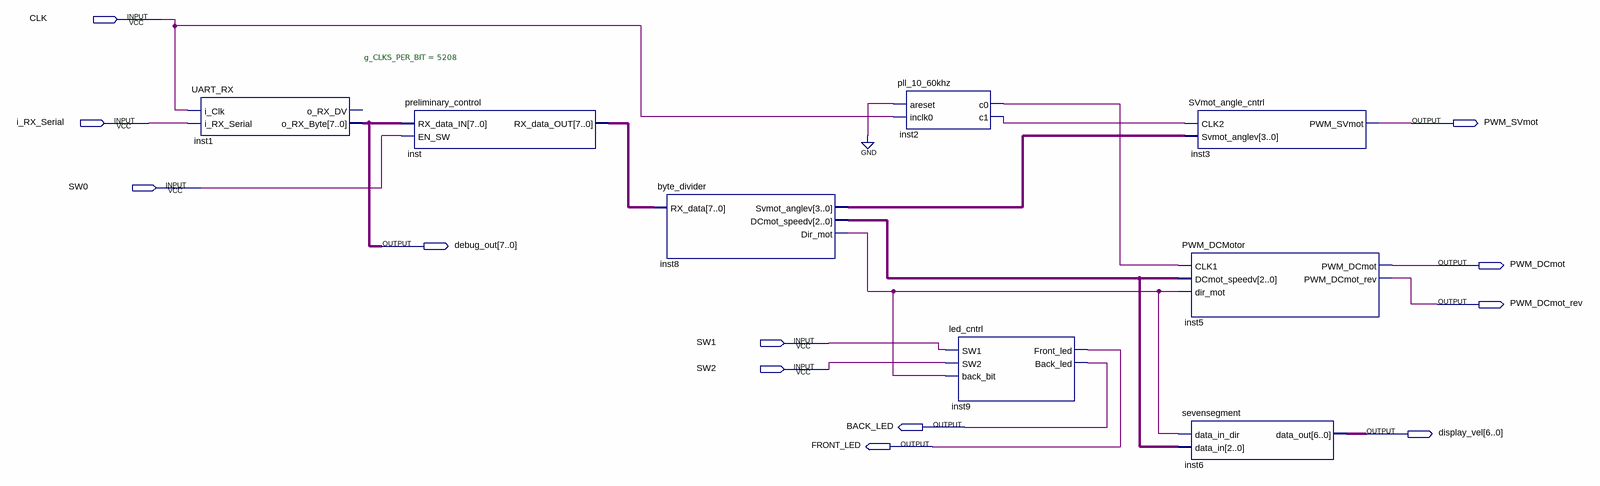
[diagram p0: schematic sheet]
// Quartus schematic Main.bdf as structural Verilog: 8 symbols, 12 pins
module Main (
  input  CLK,
  input  i_RX_Serial,
  input  SW0,
  input  SW1,
  input  SW2,
  output PWM_SVmot,
  output [7:0] debug_out,
  output PWM_DCmot,
  output PWM_DCmot_rev,
  output BACK_LED,
  output [6:0] display_vel,
  output FRONT_LED
);

  wire inst2_c0, inst2_c1, inst8_dir_mot;
  wire [2:0] inst8_dcmot_speedv;
  wire [3:0] inst8_svmot_anglev;
  wire [7:0] inst_rx_data_out;

  UART_RX #(.g_CLKS_PER_BIT(5208)) inst1 (
    .i_Clk(CLK), .i_RX_Serial(i_RX_Serial), .o_RX_Byte(debug_out));  // open: o_RX_DV
  preliminary_control inst (.RX_data_IN(debug_out), .EN_SW(SW0), .RX_data_OUT(inst_rx_data_out));
  byte_divider inst8 (
    .RX_data(inst_rx_data_out), .Svmot_anglev(inst8_svmot_anglev), .DCmot_speedv(inst8_dcmot_speedv),
    .Dir_mot(inst8_dir_mot));
  pll_10_60khz inst2 (.areset(1'b0), .inclk0(CLK), .c0(inst2_c0), .c1(inst2_c1));
  led_cntrl inst9 (.SW1(SW1), .SW2(SW2), .back_bit(inst8_dir_mot), .Front_led(FRONT_LED), .Back_led(BACK_LED));
  SVmot_angle_cntrl inst3 (.CLK2(inst2_c1), .Svmot_anglev(inst8_svmot_anglev), .PWM_SVmot(PWM_SVmot));
  PWM_DCMotor inst5 (
    .CLK1(inst2_c0), .DCmot_speedv(inst8_dcmot_speedv), .dir_mot(inst8_dir_mot), .PWM_DCmot(PWM_DCmot),
    .PWM_DCmot_rev(PWM_DCmot_rev));
  sevensegment inst6 (.data_in_dir(inst8_dir_mot), .data_in(inst8_dcmot_speedv), .data_out(display_vel));
endmodule
